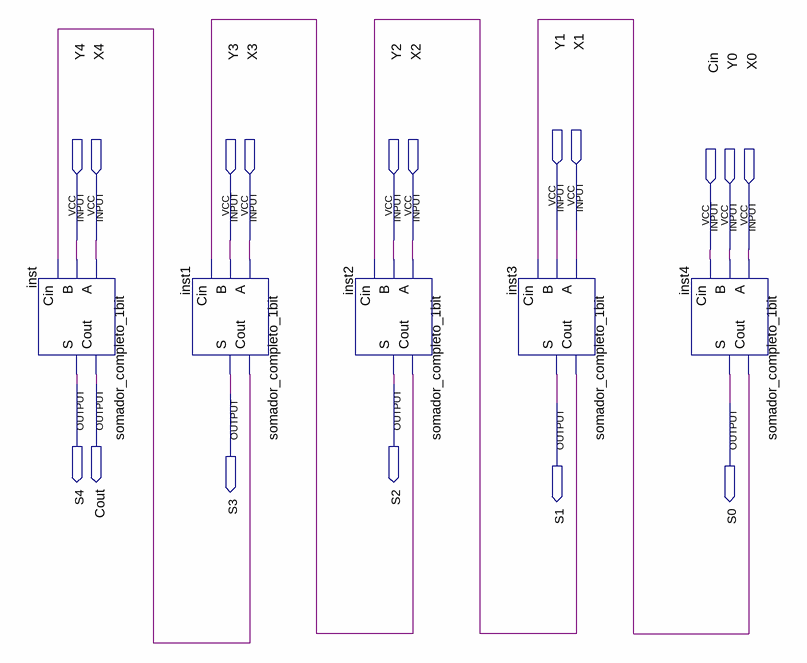
[diagram p0: schematic sheet]
// Quartus schematic somador_5bits.bdf as structural Verilog: 5 symbols, 17 pins
module somador_5bits (
  input  Y1,
  input  X1,
  input  Y4,
  input  X4,
  input  Y3,
  input  X3,
  input  Y2,
  input  X2,
  input  Cin,
  input  Y0,
  input  X0,
  output S4,
  output Cout,
  output S2,
  output S3,
  output S1,
  output S0
);

  wire inst1_cout, inst2_cout, inst3_cout, inst4_cout;

  somador_completo_1bit inst (.A(X4), .B(Y4), .Cin(inst1_cout), .Cout(Cout), .S(S4));
  somador_completo_1bit inst1 (.A(X3), .B(Y3), .Cin(inst2_cout), .Cout(inst1_cout), .S(S3));
  somador_completo_1bit inst2 (.A(X2), .B(Y2), .Cin(inst3_cout), .Cout(inst2_cout), .S(S2));
  somador_completo_1bit inst3 (.A(X1), .B(Y1), .Cin(inst4_cout), .Cout(inst3_cout), .S(S1));
  somador_completo_1bit inst4 (.A(X0), .B(Y0), .Cin(Cin), .Cout(inst4_cout), .S(S0));
endmodule
